# Altium schematic sheet Sensors.SchDoc
size B; SheetNumber: 4; SheetTotal: 7
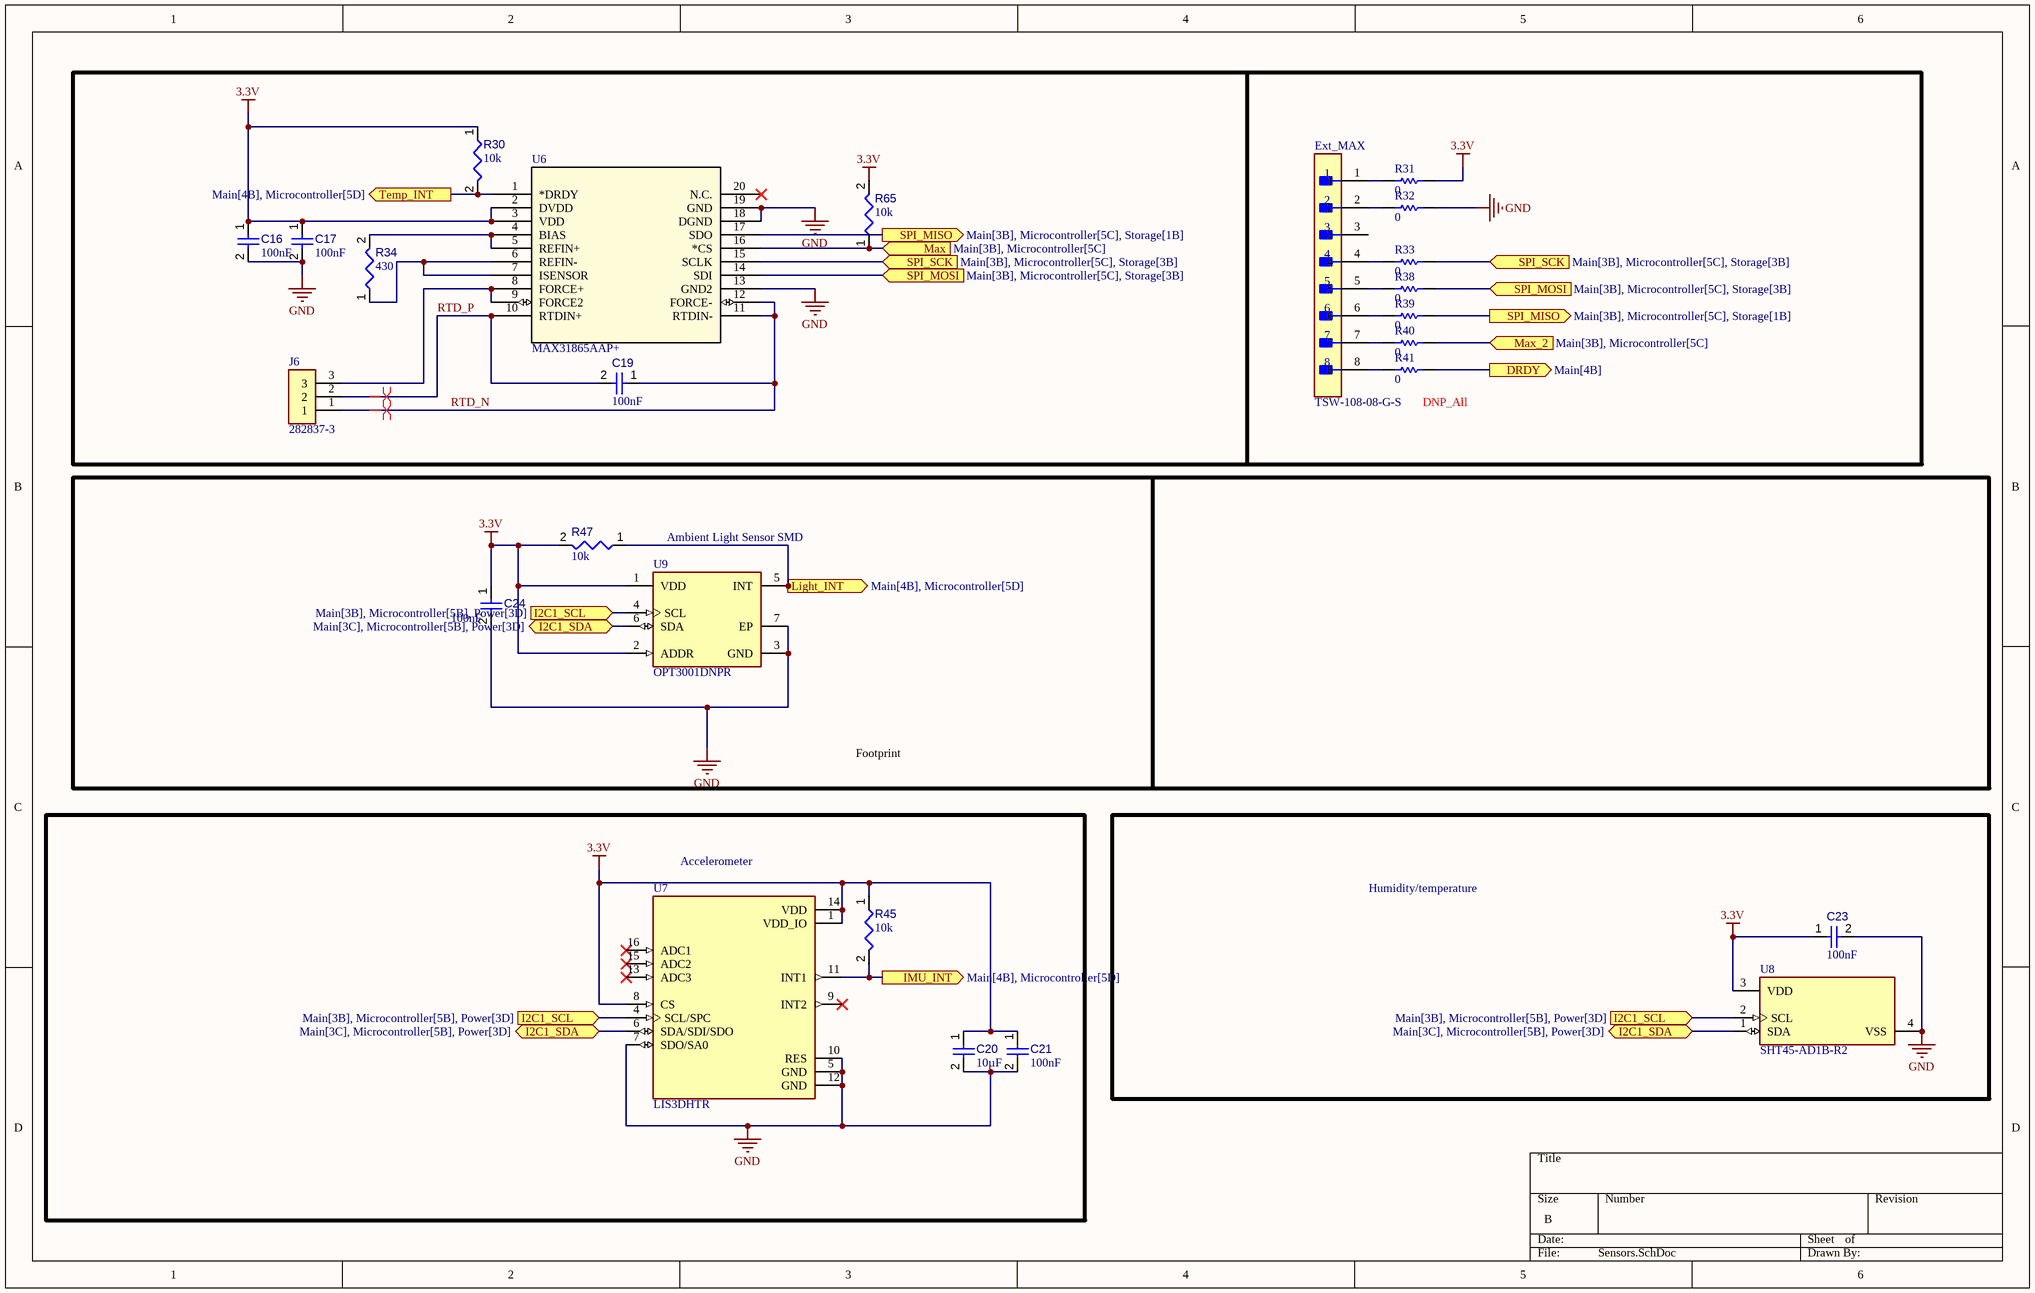
[diagram p0: Sensors.SchDoc]

## Parts
C16  value 100nF  [FP-GCJ188-0_2-IPC_C]  (hidden comment: GCJ188R71C104KA01D)
C17  value 100nF  [FP-GCJ188-0_2-IPC_C]  (hidden comment: GCJ188R71C104KA01D)
C19  value 100nF  [FP-GCJ188-0_2-IPC_C]  (hidden comment: GCJ188R71C104KA01D)
C20  value 10µF  [CAPC3216X180X50NL20T25]  (hidden comment: Capacitor 10 uF +/- 10% 16 V 1206)
C21  value 100nF  [FP-GCJ188-0_2-IPC_C]  (hidden comment: GCJ188R71C104KA01D)
C23  value 100nF  [FP-GCJ188-0_2-IPC_C]  (hidden comment: GCJ188R71C104KA01D)
C24  value 100nF  [FP-GCJ188-0_2-IPC_C]  (hidden comment: GCJ188R71C104KA01D)
Ext_MAX  TSW-108-08-G-S  [FP-TSW-108-08-G-S-MFG]
J6  282837-3  [TE_282837-3]
R30  value 10k  [RESC3216X60X45ML15T20]  (hidden comment: Resistor 10k +/-1% 1206 250 mW)
R31  value 0  [RESC2013X60X35ML10T20]  (hidden comment: Resistor 0R +/- 5% 0805 125 mW)
R32  value 0  [RESC2013X60X35ML10T20]  (hidden comment: Resistor 0R +/- 5% 0805 125 mW)
R33  value 0  [RESC2013X60X35ML10T20]  (hidden comment: Resistor 0R +/- 5% 0805 125 mW)
R34  value 430  [FP-RT0805-MFG]  (hidden comment: RT0805BRD07430RL)
R38  value 0  [RESC2013X60X35ML10T20]  (hidden comment: Resistor 0R +/- 5% 0805 125 mW)
R39  value 0  [RESC2013X60X35ML10T20]  (hidden comment: Resistor 0R +/- 5% 0805 125 mW)
R40  value 0  [RESC2013X60X35ML10T20]  (hidden comment: Resistor 0R +/- 5% 0805 125 mW)
R41  value 0  [RESC2013X60X35ML10T20]  (hidden comment: Resistor 0R +/- 5% 0805 125 mW)
R45  value 10k  [RESC3216X60X45ML15T20]  (hidden comment: Resistor 10k +/-1% 1206 250 mW)
R47  value 10k  [RESC3216X60X45ML15T20]  (hidden comment: Resistor 10k +/-1% 1206 250 mW)
R65  value 10k  [RESC2013X50X35ML15T15]  (hidden comment: Resistor 10k +/-1% 0805 125 mW)
U6  MAX31865AAP+  [SOP65P777X199-20N]
U7  LIS3DHTR  [XDCR_LIS3DHTR]
U8  SHT45-AD1B-R2  [FP-SHT45-AD1B-R2-MFG]
U9  OPT3001DNPR  [FP-DNP0006A-MFG]

## Blocks framed on the sheet
DNP_All: C16 C17 C19 Ext_MAX J6 R30-R34 R38-R41 R65 U6
Ambient Light Sensor SMD: C24 R47 U9
Accelerometer: C20 C21 R45 U7
Humidity/temperature: C23 U8

## Ports
DRDY (out, see Main[4B]), I2C1_SCL (in, see Main[3B], Microcontroller[5B], Power[3D]), I2C1_SDA (bidir, see Main[3C], Microcontroller[5B], Power[3D]), IMU_INT (out, see Main[4B], Microcontroller[5D]), Light_INT (out, see Main[4B], Microcontroller[5D]), Max (in, see Main[3B], Microcontroller[5C]), Max_2 (in, see Main[3B], Microcontroller[5C]), SPI_MISO (out, see Main[3B], Microcontroller[5C], Storage[1B]), SPI_MOSI (in, see Main[3B], Microcontroller[5C], Storage[3B]), SPI_SCK (in, see Main[3B], Microcontroller[5C], Storage[3B]), Temp_INT (out, see Main[4B], Microcontroller[5D])

## Nets
3.3V: C16.1 C17.1 C20.1 C21.1 C23.1 C24.1 R30.1 R31.2 R45.1 R47.2 R65.2 U6.2(DVDD) U6.3(VDD) U7.1(VDD_IO) U7.8(CS) U7.14(VDD) U8.3(VDD) U9.1(VDD) U9.2(ADDR)
GND: C16.2 C17.2 C20.2 C21.2 C23.2 C24.2 R32.2 U6.13(GND2) U6.18(DGND) U6.19(GND) U7.5(GND) U7.7(SDO/SA0) U7.10(RES) U7.12(GND) U8.4(VSS) U9.3(GND) U9.7(EP)
DRDY: R41.2 ; port DRDY
I2C1_SCL: U7.4(SCL/SPC) U8.2(SCL) U9.4(SCL) ; port I2C1_SCL
I2C1_SDA: U7.6(SDA/SDI/SDO) U8.1(SDA) U9.6(SDA) ; port I2C1_SDA
IMU_INT: R45.2 U7.11(INT1) ; port IMU_INT
Light_INT: R47.1 U9.5(INT) ; port Light_INT
Max: R65.1 U6.16(*CS) ; port Max
Max_2: R40.2 ; port Max_2
RTD_N: C19.1 J6.1 U6.11(RTDIN-) U6.12(FORCE-)
RTD_P: C19.2 J6.2 U6.10(RTDIN+)
SPI_MISO: R39.2 U6.17(SDO) ; port SPI_MISO
SPI_MOSI: R38.2 U6.14(SDI) ; port SPI_MOSI
SPI_SCK: R33.2 U6.15(SCLK) ; port SPI_SCK
Temp_INT: R30.2 U6.1(*DRDY) ; port Temp_INT
NetExt_MAX_1: Ext_MAX.1 R31.1
NetExt_MAX_2: Ext_MAX.2 R32.1
NetExt_MAX_4: Ext_MAX.4 R33.1
NetExt_MAX_5: Ext_MAX.5 R38.1
NetExt_MAX_6: Ext_MAX.6 R39.1
NetExt_MAX_7: Ext_MAX.7 R40.1
NetExt_MAX_8: Ext_MAX.8 R41.1
NetJ6_3: J6.3 U6.8(FORCE+) U6.9(FORCE2)
NetR34_1: R34.1 U6.6(REFIN-) U6.7(ISENSOR)
NetR34_2: R34.2 U6.4(BIAS) U6.5(REFIN+)

Not connected (* = marked no-connect by the designer): Ext_MAX 3; U6 20(N.C.)*; U7 9(INT2)* 13(ADC3)* 15(ADC2)* 16(ADC1)*

## Layout directives
differential pair: RTD_N, RTD_P

## Notes on the sheet
- Footprint

## Library data of the parts
C16 C17 C19 C21 C23 C24 = CMP-001-00083-1: 16V 100nF X7R ±10% 0603 Multilayer Ceramic Capacitors MLCC - SMD/SMT ROHS; Max Operating Temperature: 125°C; Mounting Technology: Surface Mount; Tolerance: 10%; Min Operating Temperature: -55°C; Case/Package: 0603; Voltage Rating: 16V
C20 = CMP-001-00016-6: Chip Capacitor, 10 uF, +/- 10%, 16 V, 1206 (3216 Metric); Capacitor Type: Ceramic; Voltage Rating: 16V; Tolerance: 10%; Min Operating Temperature: -55°C; Pins: 2; Mounting Technology: SM; Case/Package: 1206; Max Operating Temperature: 125°C; RoHS Compliant: True
Ext_MAX = CMP-02766-000001-1: CONN HEADER VERT 8POS 2.54MM; Manufacturer: Samtec; Number Of Contacts: 8; Conn Orientation: Straight; Conn Gender: Male; Device Class L1: Connectors; ComponentLink2Description: Datasheet; Digikey Description: CONN HEADER VERT 8POS 2.54MM; ComponentLink2URL: http://suddendocs.samtec.com/catalog_english/tsw_th.pdf; Temperature: -55°C to +125°C; RoHS: TRUE; Mouser Description: TSW - Samtec 2.54mm Pin Header 13.46mm Overall Pin Length 5.08mm Tail; Automotive: No; Temperature Range High: +125°C; Package: TSW-108-08-G-S; Device Class L3: unset; Manufacturer Part Number: TSW-108-08-G-S; Pitch: 2.54mm; Number Of Rows: 1; Lead Free: Yes; Height: 8.71mm; Contact Material: Gold,Nickel; Footprint Url: http://suddendocs.samtec.com/prints/tsw-xxx-xx-x-x-xx-xxx-footprint.pdf; Temperature Range Low: -55°C; Octopart: https://octopart.com/tsw-108-08-g-s-samtec-272653; Category: Conn; Device Class L2: Headers and Wire Housings
J6 = CMP-002-00083-1: TERMI-BLOK PCB MOUNT 3P; Availability: Unavailable; Case/Package: None; Source: 282837-3.SchLib; MP: 282837-3; Component Type: Standard; Value: *; Design Item ID: 282837-3; Price: None; Pins: 3; Manufacturer Part Number 1: 282837-3
R30 R45 R47 = CMP-009-00016-5: Chip Resistor, 10 KOhm, +/- 1%, 0.25 W, -55 to 155 degC, 1206 (3216 Metric); Power: 250mW; Voltage Rating: 200V; Pins: 2; Max Operating Temperature: 155°C; Tolerance: 1%; RoHS Compliant: True; Case/Package: 1206; Min Operating Temperature: -55°C; Mounting Technology: SM
R31-R33 R38-R41 = CMP-009-00007-5: Chip Resistor, 0 Ohm, 0.125 W, -55 to 155 degC, 0805 (2012 Metric); Power: 125mW; Voltage Rating: 50V; RoHS Compliant: True; Max Operating Temperature: 155°C; Case/Package: 0805; Mounting Technology: SM; Min Operating Temperature: -55°C; Tolerance: 5%; Pins: 2
R34 = CMP-009-00179-1: 125mW Thin Film Resistor ±25ppm/℃ ±0.1% 430Ω 0805 Chip Resistor - Surface Mount ROHS; Voltage Rating: 150V; Case/Package: 0805; Mounting Technology: Surface Mount; Tolerance: 0.1%; Max Operating Temperature: 155°C; Min Operating Temperature: -55°C
R65 = CMP-009-00018-5: Chip Resistor, 10 KOhm, +/- 1%, 125 mW, -55 to 155 degC, 0805 (2012 Metric); Power: 125mW; Voltage Rating: 150V; Tolerance: 1%; Pins: 2; Min Operating Temperature: -55°C; Case/Package: 0805; Max Operating Temperature: 155°C; RoHS Compliant: True; Mounting Technology: SM
U6 = MAX31865AAP+: RTD-to-Digital Converter; Manufacturer_Name: Analog Devices Inc; Copyright: Copyright (C) 2025 Ultra Librarian. All rights reserved.; Manufacturer Part Number 1: MAX31865AAP+; RefDes: RefDes; Type: Type; Manufacturer Part Number: MAX31865AAP+
U7 = CMP-010-00027-1: Accelerometer X, Y, Z Axis Â±2g, 4g, 8g, 16g 0.5Hz ~ 625Hz 16-LGA (3x3); MF: STMicroelectronics; Value: *; Pins: 14; MP: LIS3DHTR; Check_prices: https://www.snapeda.com/parts/LIS3DHTR/STMicroelectronics/view-part/278195/?ref=eda; Source: LIS3DHTR.SchLib; SnapEDA_Link: https://www.snapeda.com/parts/LIS3DHTR/STMicroelectronics/view-part/278195/?ref=snap; Case/Package: LGA-16 STMicroelectronics; Digi-Key_Part_Number: 497-10613-1-ND; Component Type: Standard; Design Item ID: LIS3DHTR; Manufacturer Part Number 1: LIS3DHTR
U8 = CMP-010-00025-1: Humidity And Temperature Sensor, Digital, CMOS, 4 Pin, Plastic/epoxy; Min Supply Voltage: 1.08V; Max Supply Voltage: 3.6V; Max Operating Temperature: 125°C; Min Operating Temperature: -40°C; Mounting Technology: Surface Mount
U9 = CMP-04942-000002-1: SENSOR OPT 550NM AMBIENT 6USON; Manufacturer: Texas Instruments; Max Junction Temp: +150°C; Operating Supply Current: 0.3-1.8uA; Sensor Output: I2C,SMBus; Max Supply Voltage: 3.6V; Min Supply Voltage: 1.6V; Standoff Height: 0mm; Package: DNP0006A; Device Class L2: Optical Sensors; Temperature Range Low: -40°C; Digikey Description: SENSOR OPT 550NM AMBIENT 6USON; Automotive: No; Category: IC; Manufacturer Part Number: OPT3001DNPR; RoHS: TRUE; ComponentLink2URL: http://www.ti.com/lit/ds/symlink/opt3001.pdf; Lead Free: Yes; Octopart: https://octopart.com/opt3001dnpr-texas+instruments-47324050; Device Class L3: unset; ComponentLink2Description: Datasheet; Device Class L1: Sensors; Temperature Range High: +85°C; Temperature: -40°C to +85°C; Height: 0.65mm; Ipc Land Pattern Name: DFN200X200X60-6